# EAGLE design Project (EAGLE 9.6.2)
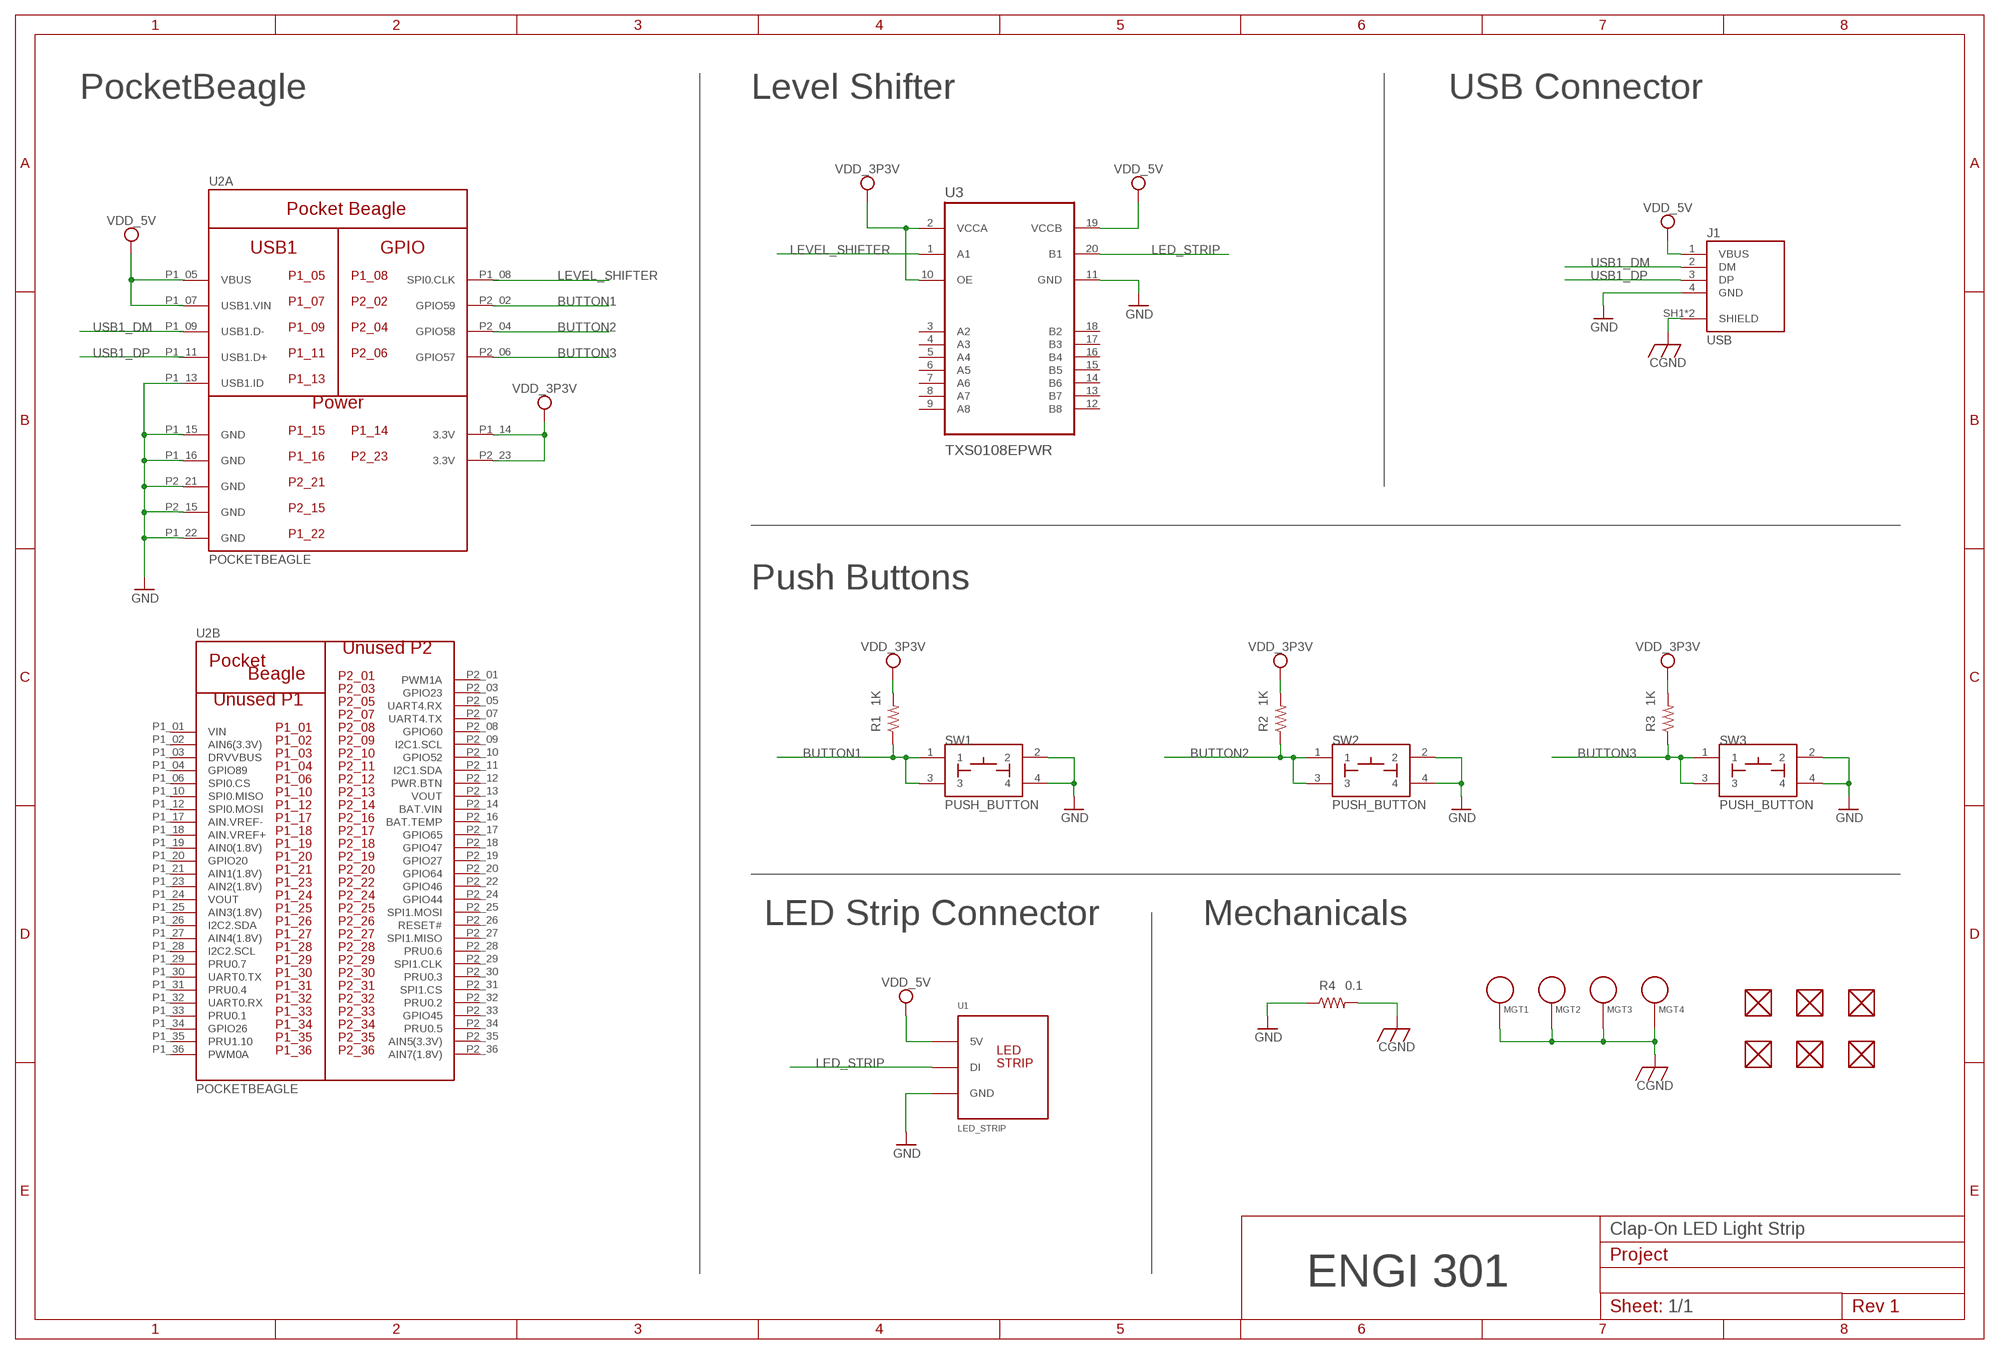
[diagram p0: schematic, sheet 1]

## Parts
FUD1  FIDUCIAL  [FIDUCIAL_40MIL]
FUD2  FIDUCIAL  [FIDUCIAL_40MIL]
FUD3  FIDUCIAL  [FIDUCIAL_40MIL]
FUD4  FIDUCIAL  [FIDUCIAL_40MIL]
FUD5  FIDUCIAL  [FIDUCIAL_40MIL]
FUD6  FIDUCIAL  [FIDUCIAL_40MIL]
J1  USB  [USB]
MGT1  MOUNTING_HOLE  [MOUNTING_HOLE]
MGT2  MOUNTING_HOLE  [MOUNTING_HOLE]
MGT3  MOUNTING_HOLE  [MOUNTING_HOLE]
MGT4  MOUNTING_HOLE  [MOUNTING_HOLE]
R1  1K  R_R0603  [R0603]
R2  1K  R_R0603  [R0603]
R3  1K  R_R0603  [R0603]
R4  0.1  R_R0805  [R0805]
SW1  PUSH_BUTTON  [BUTTON_12.5MM]
SW2  PUSH_BUTTON  [BUTTON_12.5MM]
SW3  PUSH_BUTTON  [BUTTON_12.5MM]
U1  LED_STRIP  [LED_STRIP]
U2  POCKETBEAGLE  [POCKETBEAGLE]
U3  TXS0108EPWR  [SOP65P640X120-20N]

## Nets
BUTTON1: R1.1 SW1.1 SW1.3 U2.P2_02(A:GPIO59)
BUTTON2: R2.1 SW2.1 SW2.3 U2.P2_04(A:GPIO58)
BUTTON3: R3.1 SW3.1 SW3.3 U2.P2_06(A:GPIO57)
CGND: J1.SH1(SHIELD) J1.SH2(SHIELD) MGT1.P$1 MGT2.P$1 MGT3.P$1 MGT4.P$1 R4.2
GND: J1.4(GND) R4.1 SW1.2 SW1.4 SW2.2 SW2.4 SW3.2 SW3.4 U1.GND U2.P1_13(A:USB1.ID) U2.P1_15(A:GND) U2.P1_16(A:GND) U2.P1_22(A:GND) U2.P2_15(A:GND) U2.P2_21(A:GND) U3.11(GND)
LED_STRIP: U1.SIG(DI) U3.20(B1)
LEVEL_SHIFTER: U2.P1_08(A:SPI0.CLK) U3.1(A1)
USB1_DM: J1.2(DM) U2.P1_09(A:USB1.D-)
USB1_DP: J1.3(DP) U2.P1_11(A:USB1.D+)
VDD_3P3V: R1.2 R2.2 R3.2 U2.P1_14(A:3.3V) U2.P2_23(A:3.3V) U3.2(VCCA) U3.10(OE)
VDD_5V: J1.1(VBUS) U1.PWR(5V) U2.P1_05(A:VBUS) U2.P1_07(A:USB1.VIN) U3.19(VCCB)
Unconnected: FUD1.P$1 FUD2.P$1 FUD3.P$1 FUD4.P$1 FUD5.P$1 FUD6.P$1 U2.P1_02(B:AIN6(3.3V)) U2.P1_03(B:DRVVBUS) U2.P1_04(B:GPIO89) U2.P1_06(B:SPI0.CS) U2.P1_10(B:SPI0.MISO) U2.P1_12(B:SPI0.MOSI) U2.P1_17(B:AIN.VREF-) U2.P1_18(B:AIN.VREF+) U2.P1_19(B:AIN0(1.8V)) U2.P1_20(B:GPIO20) U2.P1_21(B:AIN1(1.8V)) U2.P1_23(B:AIN2(1.8V)) U2.P1_25(B:AIN3(1.8V)) U2.P1_26(B:I2C2.SDA) U2.P1_27(B:AIN4(1.8V)) U2.P1_28(B:I2C2.SCL) U2.P1_29(B:PRU0.7) U2.P1_30(B:UART0.TX) U2.P1_31(B:PRU0.4) U2.P1_32(B:UART0.RX) U2.P1_33(B:PRU0.1) U2.P1_34(B:GPIO26) U2.P1_35(B:PRU1.10) U2.P1_36(B:PWM0A) U2.P2_01(B:PWM1A) U2.P2_03(B:GPIO23) U2.P2_05(B:UART4.RX) U2.P2_07(B:UART4.TX) U2.P2_08(B:GPIO60) U2.P2_09(B:I2C1.SCL) U2.P2_10(B:GPIO52) U2.P2_11(B:I2C1.SDA) U2.P2_12(B:PWR.BTN) U2.P2_16(B:BAT.TEMP) U2.P2_17(B:GPIO65) U2.P2_18(B:GPIO47) U2.P2_19(B:GPIO27) U2.P2_20(B:GPIO64) U2.P2_22(B:GPIO46) U2.P2_24(B:GPIO44) U2.P2_25(B:SPI1.MOSI) U2.P2_26(B:RESET#) U2.P2_27(B:SPI1.MISO) U2.P2_28(B:PRU0.6) U2.P2_29(B:SPI1.CLK) U2.P2_30(B:PRU0.3) U2.P2_31(B:SPI1.CS) U2.P2_32(B:PRU0.2) U2.P2_33(B:GPIO45) U2.P2_34(B:PRU0.5) U2.P2_35(B:AIN5(3.3V)) U2.P2_36(B:AIN7(1.8V)) U3.3(A2) U3.4(A3) U3.5(A4) U3.6(A5) U3.7(A6) U3.8(A7) U3.9(A8) U3.12(B8) U3.13(B7) U3.14(B6) U3.15(B5) U3.16(B4) U3.17(B3) U3.18(B2)

## Notes on the sheet
- PocketBeagle | Level Shifter | USB Connector
- Push Buttons
- LED Strip Connector | Mechanicals
- Clap-On LED Light Strip
- ENGI 301
- 1/1

## Power pins joined to a net without a drawn wire
BAT.VIN: U2.P2_14(B:BAT.VIN)
VIN: U2.P1_01(B:VIN)
VOUT: U2.P1_24(B:VOUT) U2.P2_13(B:VOUT)

## Library data of the parts
FUD1-FUD6 = Project:FIDUCIAL
J1 = Project:USB: 292303-1 USB Connector
MGT1-MGT4 = Project:MOUNTING_HOLE: Chassis Mounting Hole w/GND connection ability
R1-R4 = Project:R_: RESISTOR, American symbol
SW1-SW3 = Project:PUSH_BUTTON
U1 = Project:LED_STRIP
U2 = Project:POCKETBEAGLE: PocketBeagle
U3 = Project:TXS0108EPWR: Check prices <https://pricing.snapeda.com/parts/TXS0108EPWR/Texas%20Instruments/view-part?ref=eda>; AVAILABILITY: In Stock; DESCRIPTION: 8-bit bidirectional voltage-level shifter for open-drain and push-pull application 20-TSSOP -40 to 85; MF: Texas Instruments; MP: TXS0108EPWR; PACKAGE: TSSOP-20 Texas Instruments; PRICE: None; PURCHASE-URL: https://pricing.snapeda.com/search/part/TXS0108EPWR/?ref=eda

## Board
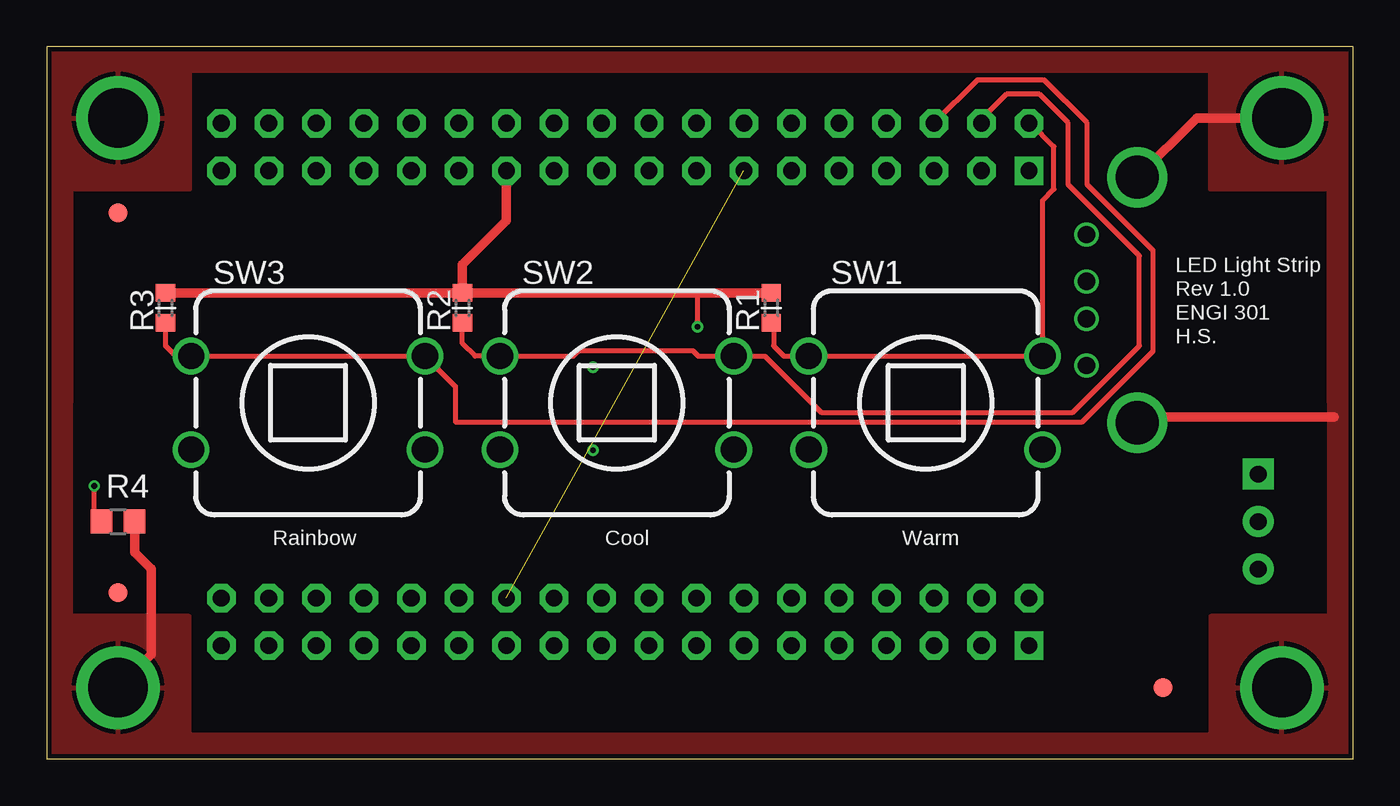
[diagram p1: board, top side]
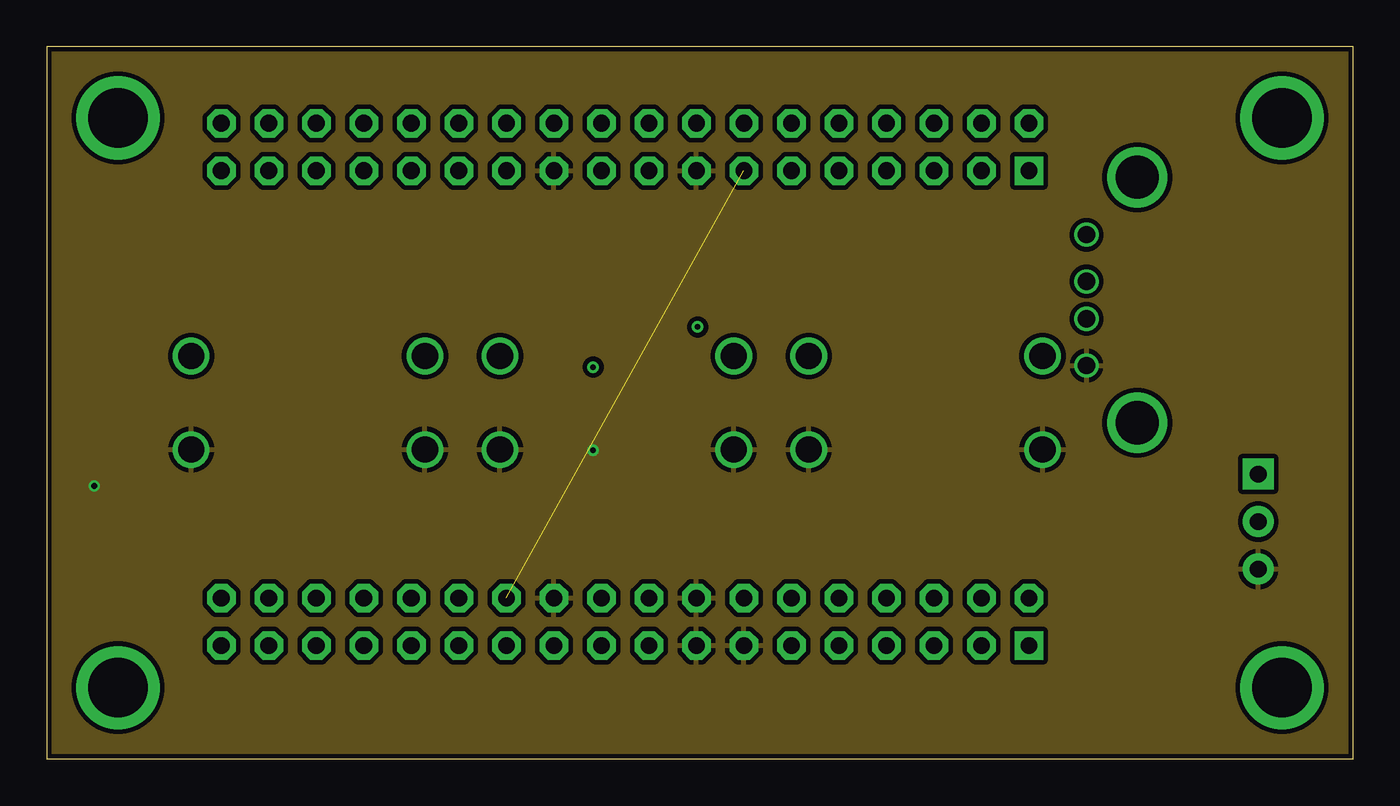
[diagram p2: board, inner layer Route2]
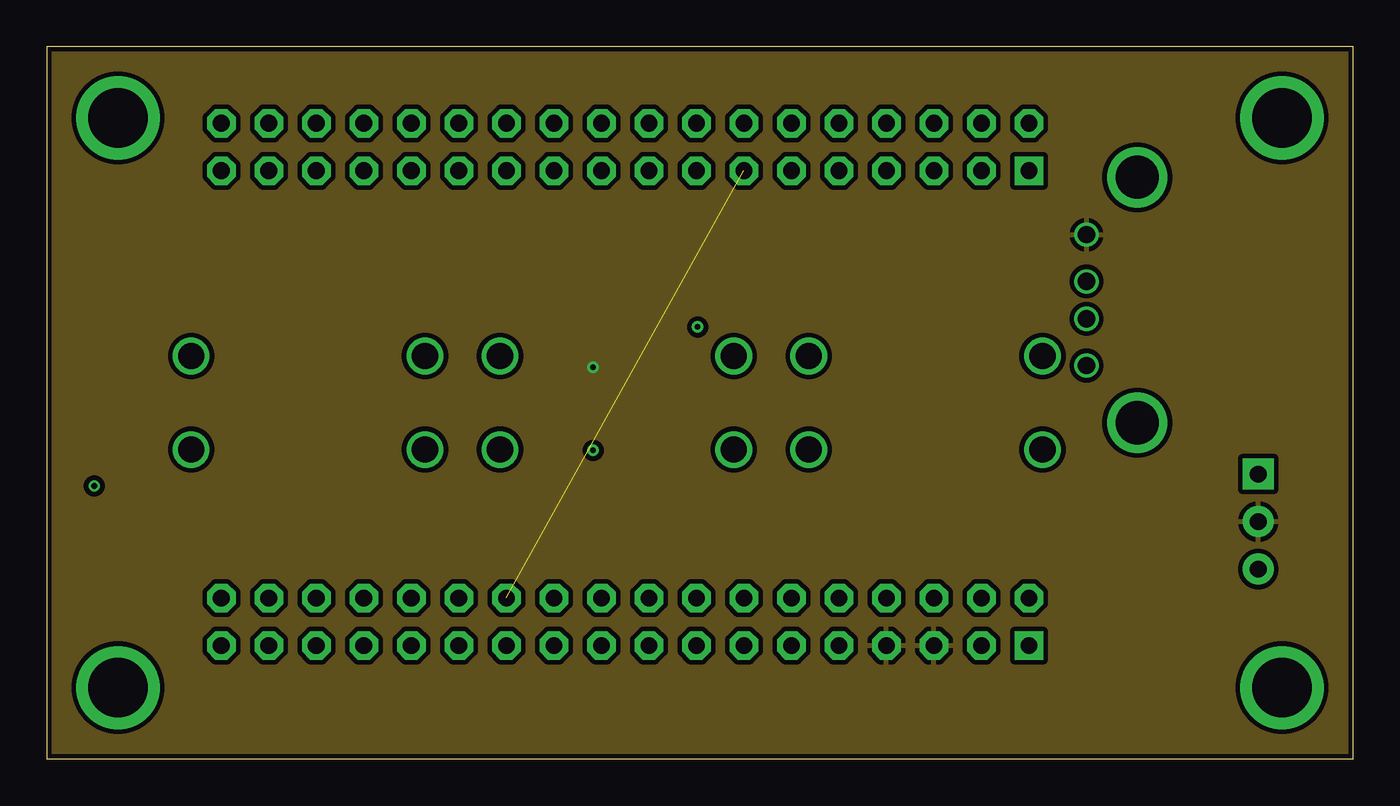
[diagram p3: board, inner layer Route15]
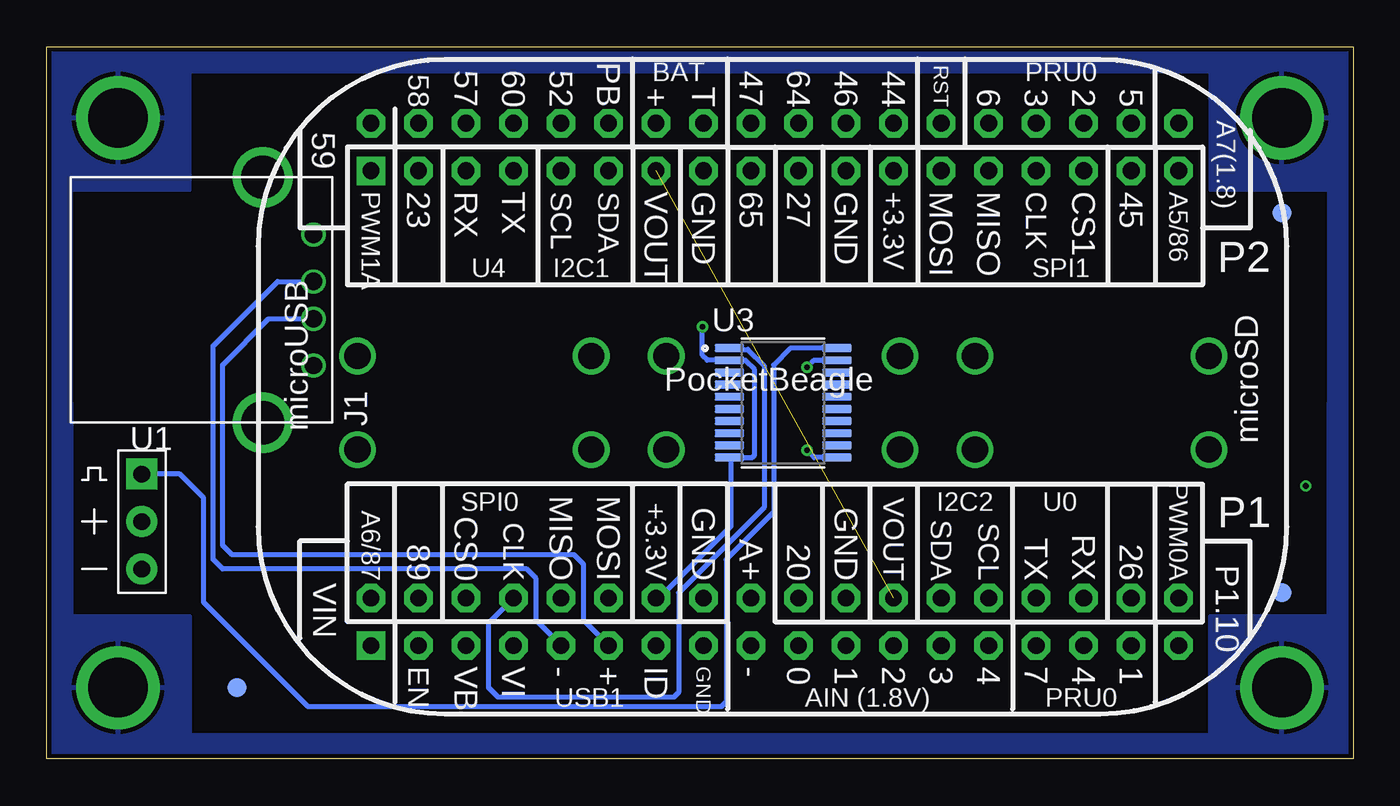
[diagram p4: board, bottom side, seen from below]

Size 69.85 x 38.1 mm. Coordinates in mm from the lower left corner, seen from the top.
Outline: 0,0 69.85,0 69.85,38.1 0,38.1 0,0
Copper layers (1*2*15*16): Top 0.035mm / dielectric 0.23mm / Route2 0.035mm / dielectric 0.93mm / Route15 0.035mm / dielectric 0.23mm / Bottom 0.035mm
Design rules "ENGI301_4lyr": minimum track width 10mil, minimum drill 12mil, track to track 10mil, track to pad 10mil, pad to pad 10mil, via to via 10mil, smd to smd 10mil, copper to edge 10mil, drill to drill 12mil, minimum pad ring 6mil, minimum via ring 6mil, stop-mask expansion 3mil, vias tented up to drill 25mil, thermal gap 10mil

### Footprints (pad centres in the part's own frame; a part is rotated, then mirrored left to right if it is on the bottom)
FIDUCIAL_40MIL = smd 1.016 x 1.016: P$1 0,0
USB = drill 0.92: 1 3.07,12.99; 2 5.57,12.99; 3 7.57,12.99; 4 10.07,12.99 | drill 2.3: SH1 0,10.28; SH2 13.13,10.28
MOUNTING_HOLE = drill 3.175 pad 4.445: P$1 0,0
R0603 = smd 0.95 x 1.031: 1 -0.8,0; 2 0.8,0
R0805 = smd 1.143 x 1.27: 1 -0.889,0; 2 0.889,0
BUTTON_12.5MM = drill 1.4: 1 -6.25,2.5; 2 -6.25,-2.5; 3 6.25,2.5; 4 6.25,-2.5
LED_STRIP = drill 0.889 pad 1.651: GND 0,-2.54; PWR 0,0 | drill 0.889 pad 1.651 square: SIG 0,2.54
POCKETBEAGLE = drill 0.889 pad 1.524 square: P1_01 5.91,3.53; P2_01 5.91,28.93 | drill 0.889 pad 1.524 octagon: P1_02 5.91,6.07; P1_03 8.45,3.53; P1_04 8.45,6.07; P1_05 10.99,3.53; P1_06 10.99,6.07; P1_07 13.53,3.53; P1_08 13.53,6.07; P1_09 16.07,3.53; P1_10 16.07,6.07; P1_11 18.61,3.53; P1_12 18.61,6.07; P1_13 21.15,3.53; P1_14 21.15,6.07; P1_15 23.69,3.53; P1_16 23.69,6.07; P1_17 26.23,3.53; P1_18 26.23,6.07; P1_19 28.77,3.53; P1_20 28.77,6.07; P1_21 31.31,3.53; P1_22 31.31,6.07; P1_23 33.85,3.53; P1_24 33.85,6.07; P1_25 36.39,3.53; P1_26 36.39,6.07; P1_27 38.93,3.53; P1_28 38.93,6.07; P1_29 41.47,3.53; P1_30 41.47,6.07; P1_31 44.01,3.53; P1_32 44.01,6.07; P1_33 46.55,3.53; P1_34 46.55,6.07; P1_35 49.09,3.53; P1_36 49.09,6.07; P2_02 5.91,31.47; P2_03 8.45,28.93; P2_04 8.45,31.47; P2_05 10.99,28.93; P2_06 10.99,31.47; P2_07 13.53,28.93; P2_08 13.53,31.47; P2_09 16.07,28.93; P2_10 16.07,31.47; P2_11 18.61,28.93; P2_12 18.61,31.47; P2_13 21.15,28.93; P2_14 21.15,31.47; P2_15 23.69,28.93; P2_16 23.69,31.47; P2_17 26.23,28.93; P2_18 26.23,31.47; P2_19 28.77,28.93; P2_20 28.77,31.47; P2_21 31.31,28.93; P2_22 31.31,31.47; P2_23 33.85,28.93; P2_24 33.85,31.47; P2_25 36.39,28.93; P2_26 36.39,31.47; P2_27 38.93,28.93; P2_28 38.93,31.47; P2_29 41.47,28.93; P2_30 41.47,31.47; P2_31 44.01,28.93; P2_32 44.01,31.47; P2_33 46.55,28.93; P2_34 46.55,31.47; P2_35 49.09,28.93; P2_36 49.09,31.47
SOP65P640X120-20N = smd 1.57 x 0.41: 1 -2.87,2.925; 2 -2.87,2.275; 3 -2.87,1.625; 4 -2.87,0.975; 5 -2.87,0.325; 6 -2.87,-0.325; 7 -2.87,-0.975; 8 -2.87,-1.625; 9 -2.87,-2.275; 10 -2.87,-2.925; 11 2.87,-2.925; 12 2.87,-2.275; 13 2.87,-1.625; 14 2.87,-0.975; 15 2.87,-0.325; 16 2.87,0.325; 17 2.87,0.975; 18 2.87,1.625; 19 2.87,2.275; 20 2.87,2.925

### Placement (x,y rotation side)
FUD1  3.81,8.89 0 top
FUD2  3.81,29.21 0 top
FUD3  59.69,3.81 0 top
FUD4  3.81,29.21 0 bottom
FUD5  3.81,8.89 0 bottom
FUD6  59.69,3.81 0 bottom
J1  68.58,31.11 270 bottom
MGT1  3.81,34.29 0 top
MGT2  3.81,3.81 0 top
MGT3  66.04,3.81 0 top
MGT4  66.04,34.29 0 top
R1  38.73,24.13 90 top
R2  22.23,24.13 90 top
R3  6.35,24.13 90 top
R4  3.81,12.7 0 top
SW1  46.99,19.05 0 top
SW2  30.48,19.05 0 top
SW3  13.97,19.05 0 top
U1  64.77,12.7 0 bottom
U2  58.42,2.54 0 bottom
U3  30.48,19.05 0 bottom

### Tracks (layer width: path | path; a pad name or v marks a point on that pad's centre or on a via)
BUTTON1
  Top 0.254: R1.1 38.86,23.2 38.86,22.1 39.41,21.55 SW1.1 SW1.3 53.24,29.87 53.85,30.48 53.85,32.77 52.6,34.01 U2.P2_02
BUTTON2
  Top 0.254: R2.1 22.23,22.23 22.9,21.55 SW2.1 28.15,21.55 28.45,21.84 34.54,21.84 34.84,21.55 SW2.3 38.39,21.55 41.4,18.54 54.86,18.54 58.42,22.1 58.42,26.92 54.61,30.73 54.61,34.04 53.09,35.56 51.31,35.56 49.97,34.22 U2.P2_04
BUTTON3
  Top 0.254: R3.1 6.35,22.1 6.9,21.55 SW3.1 SW3.3 21.84,19.93 21.84,18.03 55.37,18.03 59.16,21.82 59.16,27.2 55.63,30.73 55.63,34.04 53.34,36.32 49.74,36.32 U2.P2_06
CGND
  Top 0.508: J1.SH1 61.48,34.29 MGT4.P$1 | MGT2.P$1 5.59,5.59 5.59,10.16 4.7,11.05 R4.2 | J1.SH2 58.6,18.29 68.83,18.29
  pour Top: 1.27,19.05 -1.27,19.05 -1.27,39.37 71.12,39.37 71.12,19.05 68.58,19.05 68.58,30.48 62.23,30.48 62.23,36.83 7.62,36.83 7.62,30.48 1.27,30.48
  pour Top: -1.27,19.05 -1.27,-1.27 71.12,-1.27 71.12,19.05 68.58,19.05 68.58,7.62 62.23,7.62 62.23,1.27 7.62,1.27 7.62,7.62 1.27,7.62 1.27,19.05
  pour Bottom: -1.27,19.05 -1.27,39.37 71.12,39.37 71.12,19.05 68.58,19.05 68.58,30.48 62.23,30.48 62.23,36.83 7.62,36.83 7.62,30.48 1.27,30.48 1.27,19.05
  pour Bottom: -1.27,19.05 -1.27,-1.27 71.12,-1.27 71.12,19.05 68.58,19.05 68.58,7.62 62.23,7.62 62.23,1.27 7.62,1.27 7.62,7.62 1.27,7.62 1.27,19.05
GND  (via drill 0.3 pad 0.61)
  Top 0.254: R4.1 2.54,13.08 v2.54,14.61
  Bottom 0.254: U3.11 28.82,16.12 v29.21,16.51
  pour Route2: -2.54,40.64 72.39,40.64 72.39,-2.54 -2.54,-2.54
LED_STRIP
  Bottom 0.254: U3.20 30.09,21.98 30.99,21.08 30.99,13.21 33.53,10.67 33.53,3.05 33.78,2.79 55.88,2.79 61.47,8.38 61.47,13.97 62.74,15.24 U1.SIG
LEVEL_SHIFTER
  Bottom 0.254: U3.1 33.29,21.91 32.37,21.91 31.5,21.04 31.5,13.46 36.07,8.89 36.07,3.56 36.32,3.3 45.72,3.3 46.23,3.81 46.23,7.27 U2.P1_08
USB1_DM
  Bottom 0.254: U2.P1_09 43.69,7.41 43.69,9.65 44.2,10.16 60.45,10.16 60.96,10.67 60.96,22.1 57.51,25.55 J1.2
USB1_DP
  Bottom 0.254: U2.P1_11 41.15,7.41 41.15,10.41 41.66,10.92 59.94,10.92 60.45,11.43 60.45,21.08 57.99,23.55 J1.3
VDD_3P3V  (via drill 0.3 pad 0.61)
  Top 0.254: v34.8,23.11 34.8,24.93
  Top 0.508: U2.P2_23 24.57,28.8 22.23,26.45 R2.2 | R2.2 34.8,24.93 R1.2 | R2.2 R3.2
  Bottom 0.254: v34.8,23.11 34.8,21.59 34.54,21.34 33.36,21.34 U3.2 32.5,21.32 32,20.83 32,16.26 32.13,16.12 U3.10 33.27,16.05 33.27,12.45 37.11,8.61 U2.P1_14
VDD_5V  (via drill 0.3 pad 0.61)
  Bottom 0.254: U3.19 28.84,21.32 v29.21,20.95
  pour Route15: -5.08,43.18 74.93,43.18 74.93,-5.08 -5.08,-5.08
VOUT  (1 unrouted)

### Text on the board
tPlace: LED Light Strip | Rev 1.0 | ENGI 301 | H.S. | Rainbow | Cool | Warm